# EAGLE design ADK_MEGA_2560-REV3 (EAGLE 6.5.0)
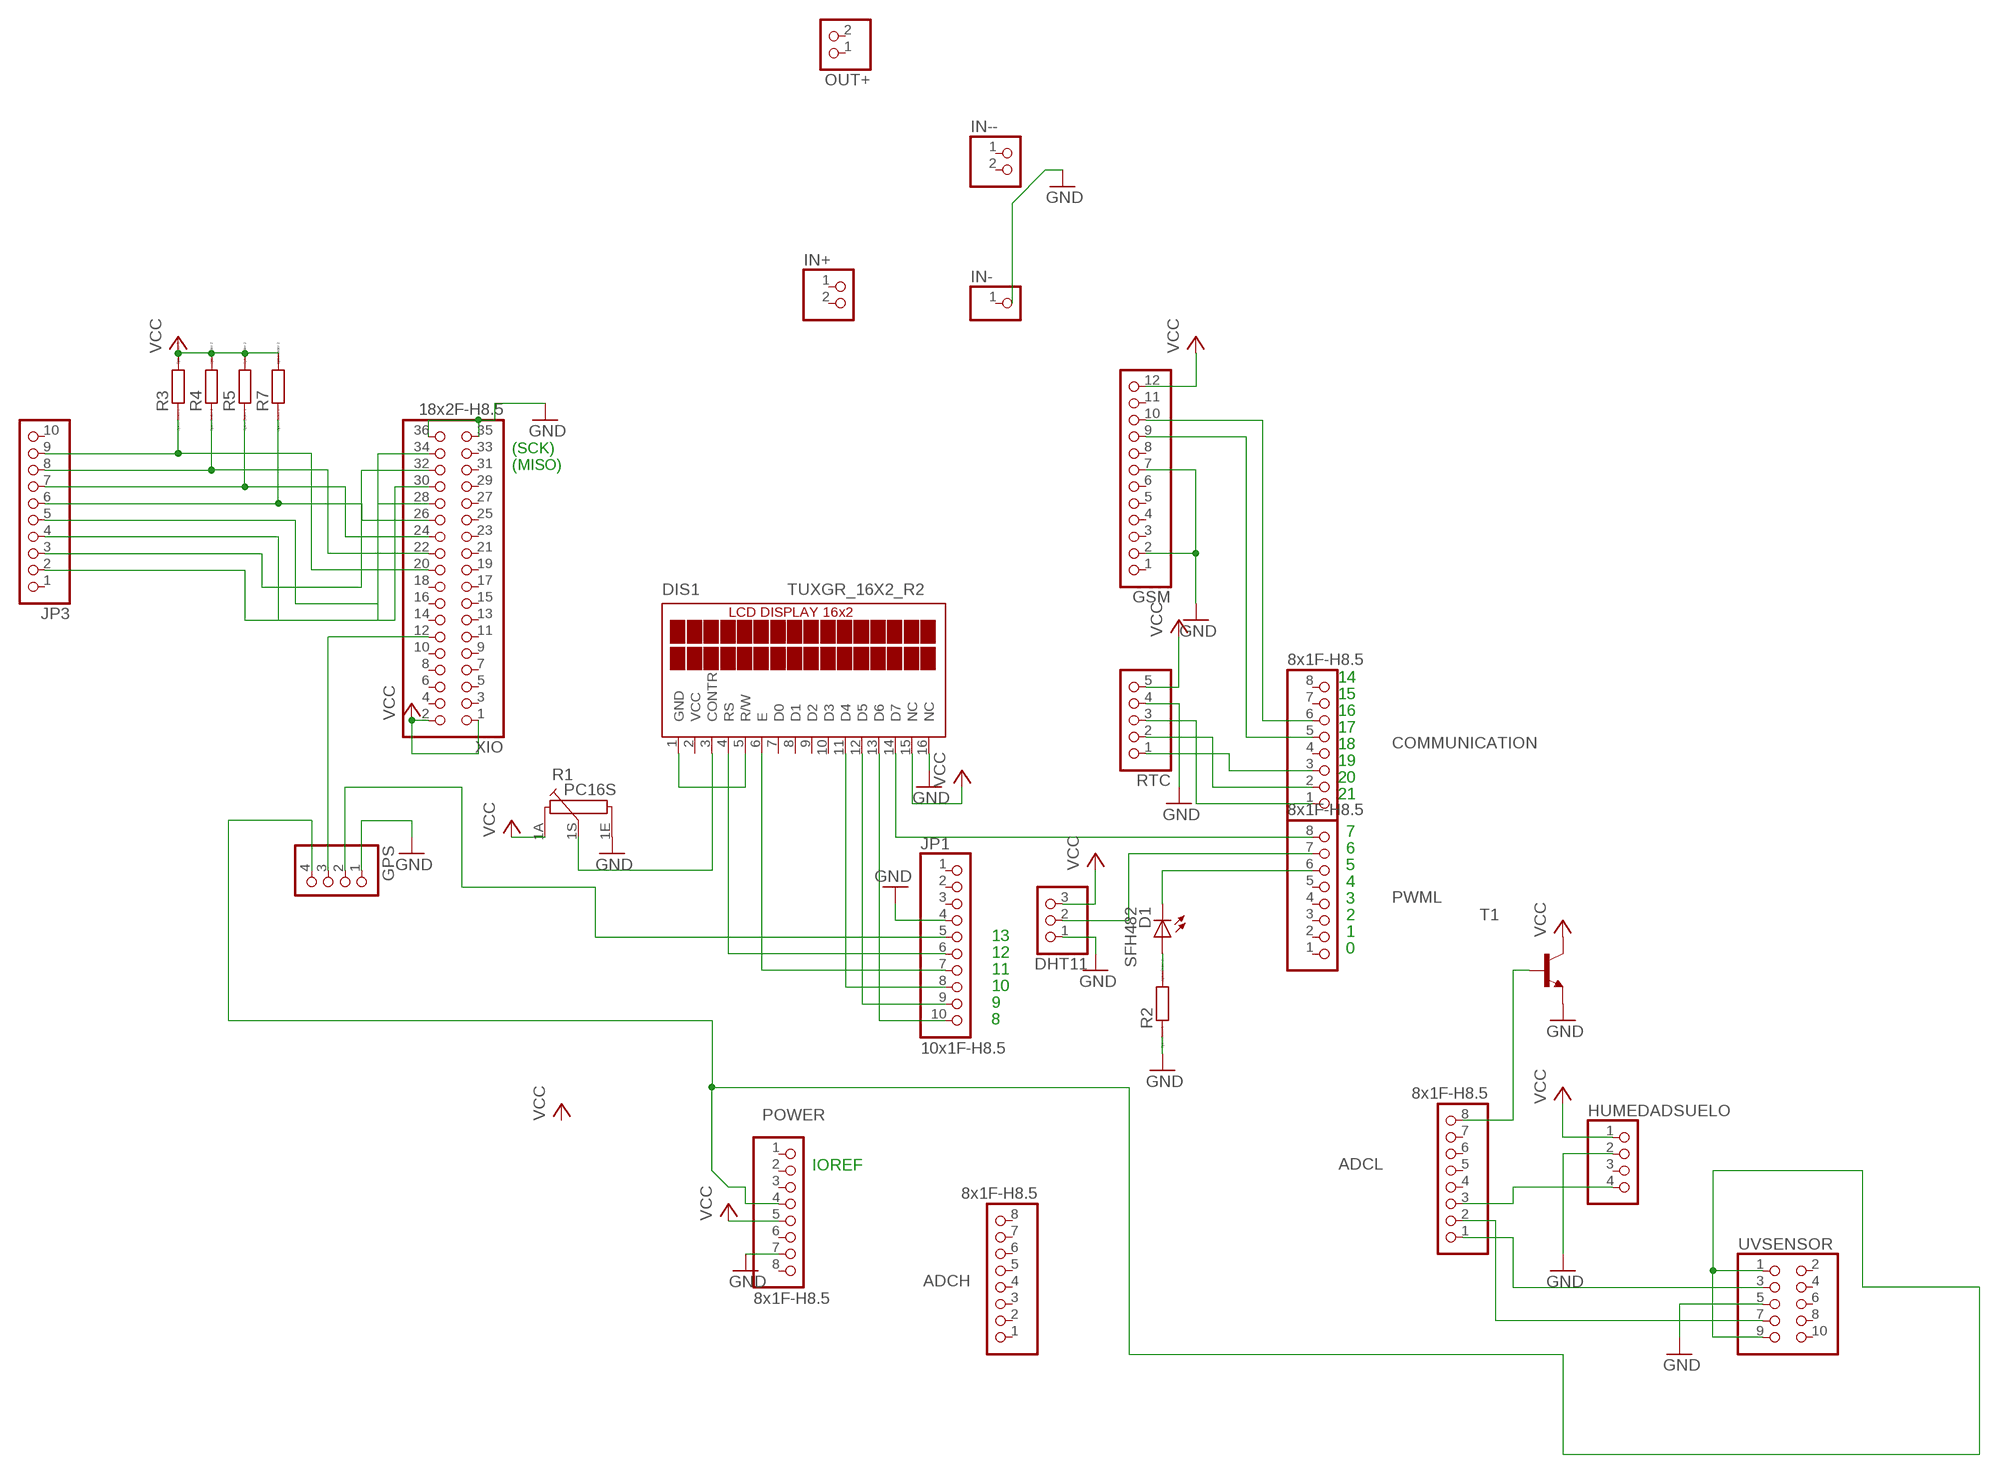
[diagram p0: schematic, sheet 1]

## Parts
ADCH  8x1F-H8.5  PINHD-1X8  [1X08]
ADCL  8x1F-H8.5  PINHD-1X8  [1X08]
COMMUNICATION  8x1F-H8.5  PINHD-1X8  [1X08]
D1  SFH482  [SFH482]
DHT11  PINHD-1X3  [1X03]
DIS1  TUXGR_16X2_R2  [TUXGR_16X2_R2]
GPS  PINHD-1X4  [1X04]
GSM  PINHD-1X12  [1X12]
HUMEDADSUELO  PINHD-1X4  [1X04]
IN+  PINHD-1X2  [1X02]
IN-  PINHD-1X1  [1X01]
IN--  PINHD-1X2  [1X02]
JP1  10x1F-H8.5  PINHD-1X10  [1X10]
JP3  PINHD-1X10/90  [1X10/90]
OUT+  PINHD-1X2  [1X02]
POWER  8x1F-H8.5  PINHD-1X8  [1X08]
PWML  8x1F-H8.5  PINHD-1X8  [1X08]
R1  PC16S  [PC16S]
R2  R0204/7  [0204/7]
R3  R0204/7  [0204/7]
R4  R0204/7  [0204/7]
R5  R0204/7  [0204/7]
R7  R0204/7  [0204/7]
RTC  PINHD-1X5  [1X05]
T1  2N2222-NPN-TO92-EBC  [TO92-EBC]
UVSENSOR  PINHD-2X5  [2X05]
XIO  18x2F-H8.5  PINHD-2X18  [2X18]

## Nets
GND: DHT11.1 DIS1.16(NC) GPS.1 GSM.2 GSM.7 HUMEDADSUELO.2 JP1.4 POWER.7 R1.1E R2.1 RTC.4 T1.E UVSENSOR.5 XIO.35 XIO.36
N$1: DIS1.3(CONTR) R1.1S
N$2: D1.K(C) PWML.6
N$3: D1.A R2.2
N$4: DIS1.14(D7) PWML.8
N$5: DIS1.1(GND) DIS1.5(R/W)
N$6: DIS1.13(D6) JP1.10
N$7: DIS1.12(D5) JP1.9
N$8: DIS1.11(D4) JP1.8
N$9: DIS1.6(E) JP1.7
N$10: DIS1.4(RS) JP1.6
N$11: GPS.2 JP1.5
N$12: DHT11.2 PWML.7
N$13: GPS.3 XIO.12
N$14: COMMUNICATION.1 RTC.3
N$15: COMMUNICATION.2 RTC.2
N$16: COMMUNICATION.3 RTC.1
N$17: ADCL.3 HUMEDADSUELO.4
N$18: ADCL.8 T1.B
N$19: ADCL.2 UVSENSOR.7
N$20: ADCL.1 UVSENSOR.3
N$22: COMMUNICATION.6 GSM.10
N$23: COMMUNICATION.5 GSM.9
N$24: JP3.9 R3.1 XIO.20
N$25: JP3.8 R4.1 XIO.22
N$26: JP3.7 R5.1 XIO.24
N$27: JP3.6 R7.1 XIO.26
N$29: GPS.4 POWER.4 UVSENSOR.1 UVSENSOR.9
N$30: JP3.5 XIO.28
N$31: JP3.4 XIO.30
N$32: JP3.3 XIO.32
N$33: JP3.2 XIO.34
VCC: DHT11.3 DIS1.15(NC) GSM.12 HUMEDADSUELO.1 POWER.5 R1.1A R3.2 R4.2 R5.2 R7.2 RTC.5 T1.C XIO.1 XIO.2
Unconnected: ADCH.1 ADCH.2 ADCH.3 ADCH.4 ADCH.5 ADCH.6 ADCH.7 ADCH.8 ADCL.4 ADCL.5 ADCL.6 ADCL.7 COMMUNICATION.4 COMMUNICATION.7 COMMUNICATION.8 DIS1.7(D0) DIS1.8(D1) DIS1.9(D2) DIS1.10(D3) GSM.1 GSM.3 GSM.4 GSM.5 GSM.6 GSM.8 GSM.11 HUMEDADSUELO.3 IN+.1 IN+.2 IN--.1 IN--.2 IN-.1 JP1.1 JP1.2 JP1.3 JP3.1 JP3.10 OUT+.1 OUT+.2 POWER.1 POWER.2 POWER.3 POWER.6 POWER.8 PWML.1 PWML.2 PWML.3 PWML.4 PWML.5 UVSENSOR.2 UVSENSOR.4 UVSENSOR.6 UVSENSOR.8 UVSENSOR.10 XIO.3 XIO.4 XIO.5 XIO.6 XIO.7 XIO.8 XIO.9 XIO.10 XIO.11 XIO.13 XIO.14 XIO.15 XIO.16 XIO.17 XIO.18 XIO.19 XIO.21 XIO.23 XIO.25 XIO.27 XIO.29 XIO.31 XIO.33

## Notes on the sheet
- (SCK)
- (MISO)
- 14
- 15
- 16
- 17
- 18
- 19
- 20
- 21
- 7
- 6
- 5
- 4
- 3
- 2
- 13 | 1
- 12 | 0
- 11
- 10
- 9
- 8
- IOREF

## Power pins joined to a net without a drawn wire
VCC: DIS1.2(VCC)

## Library data of the parts
ADCH ADCL COMMUNICATION POWER PWML = SmartPrj:PINHD-1X8: PIN HEADER
D1 = led:SFH482: IR LED infrared emitting diode, Infineon
DHT11 = pinhead:PINHD-1X3: PIN HEADER
DIS1 = display-lcd:TUXGR_16X2_R2: Tuxgraphics LCD display 16x2 characters reflective, without background light Source: tuxgr_12x2_r2.pdf; OC_FARNELL: unknown; OC_NEWARK: unknown
GPS HUMEDADSUELO = pinhead:PINHD-1X4: PIN HEADER
GSM = pinhead:PINHD-1X12: PIN HEADER
IN+ IN-- OUT+ = pinhead:PINHD-1X2: PIN HEADER
IN- = pinhead:PINHD-1X1: PIN HEADER
JP1 = SmartPrj:PINHD-1X10: PIN HEADER
JP3 = pinhead:PINHD-1X10: PIN HEADER
R1 = piher:PC16S: POTENTIOMETER single carbon potentiometer, 16 mm, S3ROH; OC_FARNELL: 4452940; OC_NEWARK: unknown
R2-R5 R7 = eagle-ltspice:R: RESISTOR, European symbol; SPICEMODEL: NONE; SPICEPREFIX: R
RTC = pinhead:PINHD-1X5: PIN HEADER
T1 = transistor-neu-to92:*-NPN-: NPN Transistror
UVSENSOR = pinhead:PINHD-2X5: PIN HEADER
XIO = SmartPrj:PINHD-2X18: PIN HEADER

## Net classes
0 default: width 0.203 mm, drill 0.406 mm, clearance 0.178 mm
1 power: width 0.305 mm, drill 0.406 mm, clearance 0.178 mm
2 gnd: width 0.305 mm, drill 0.406 mm, clearance 0.178 mm
3 power usb: width 0.508 mm, drill 0.406 mm, clearance 0.178 mm

## Board
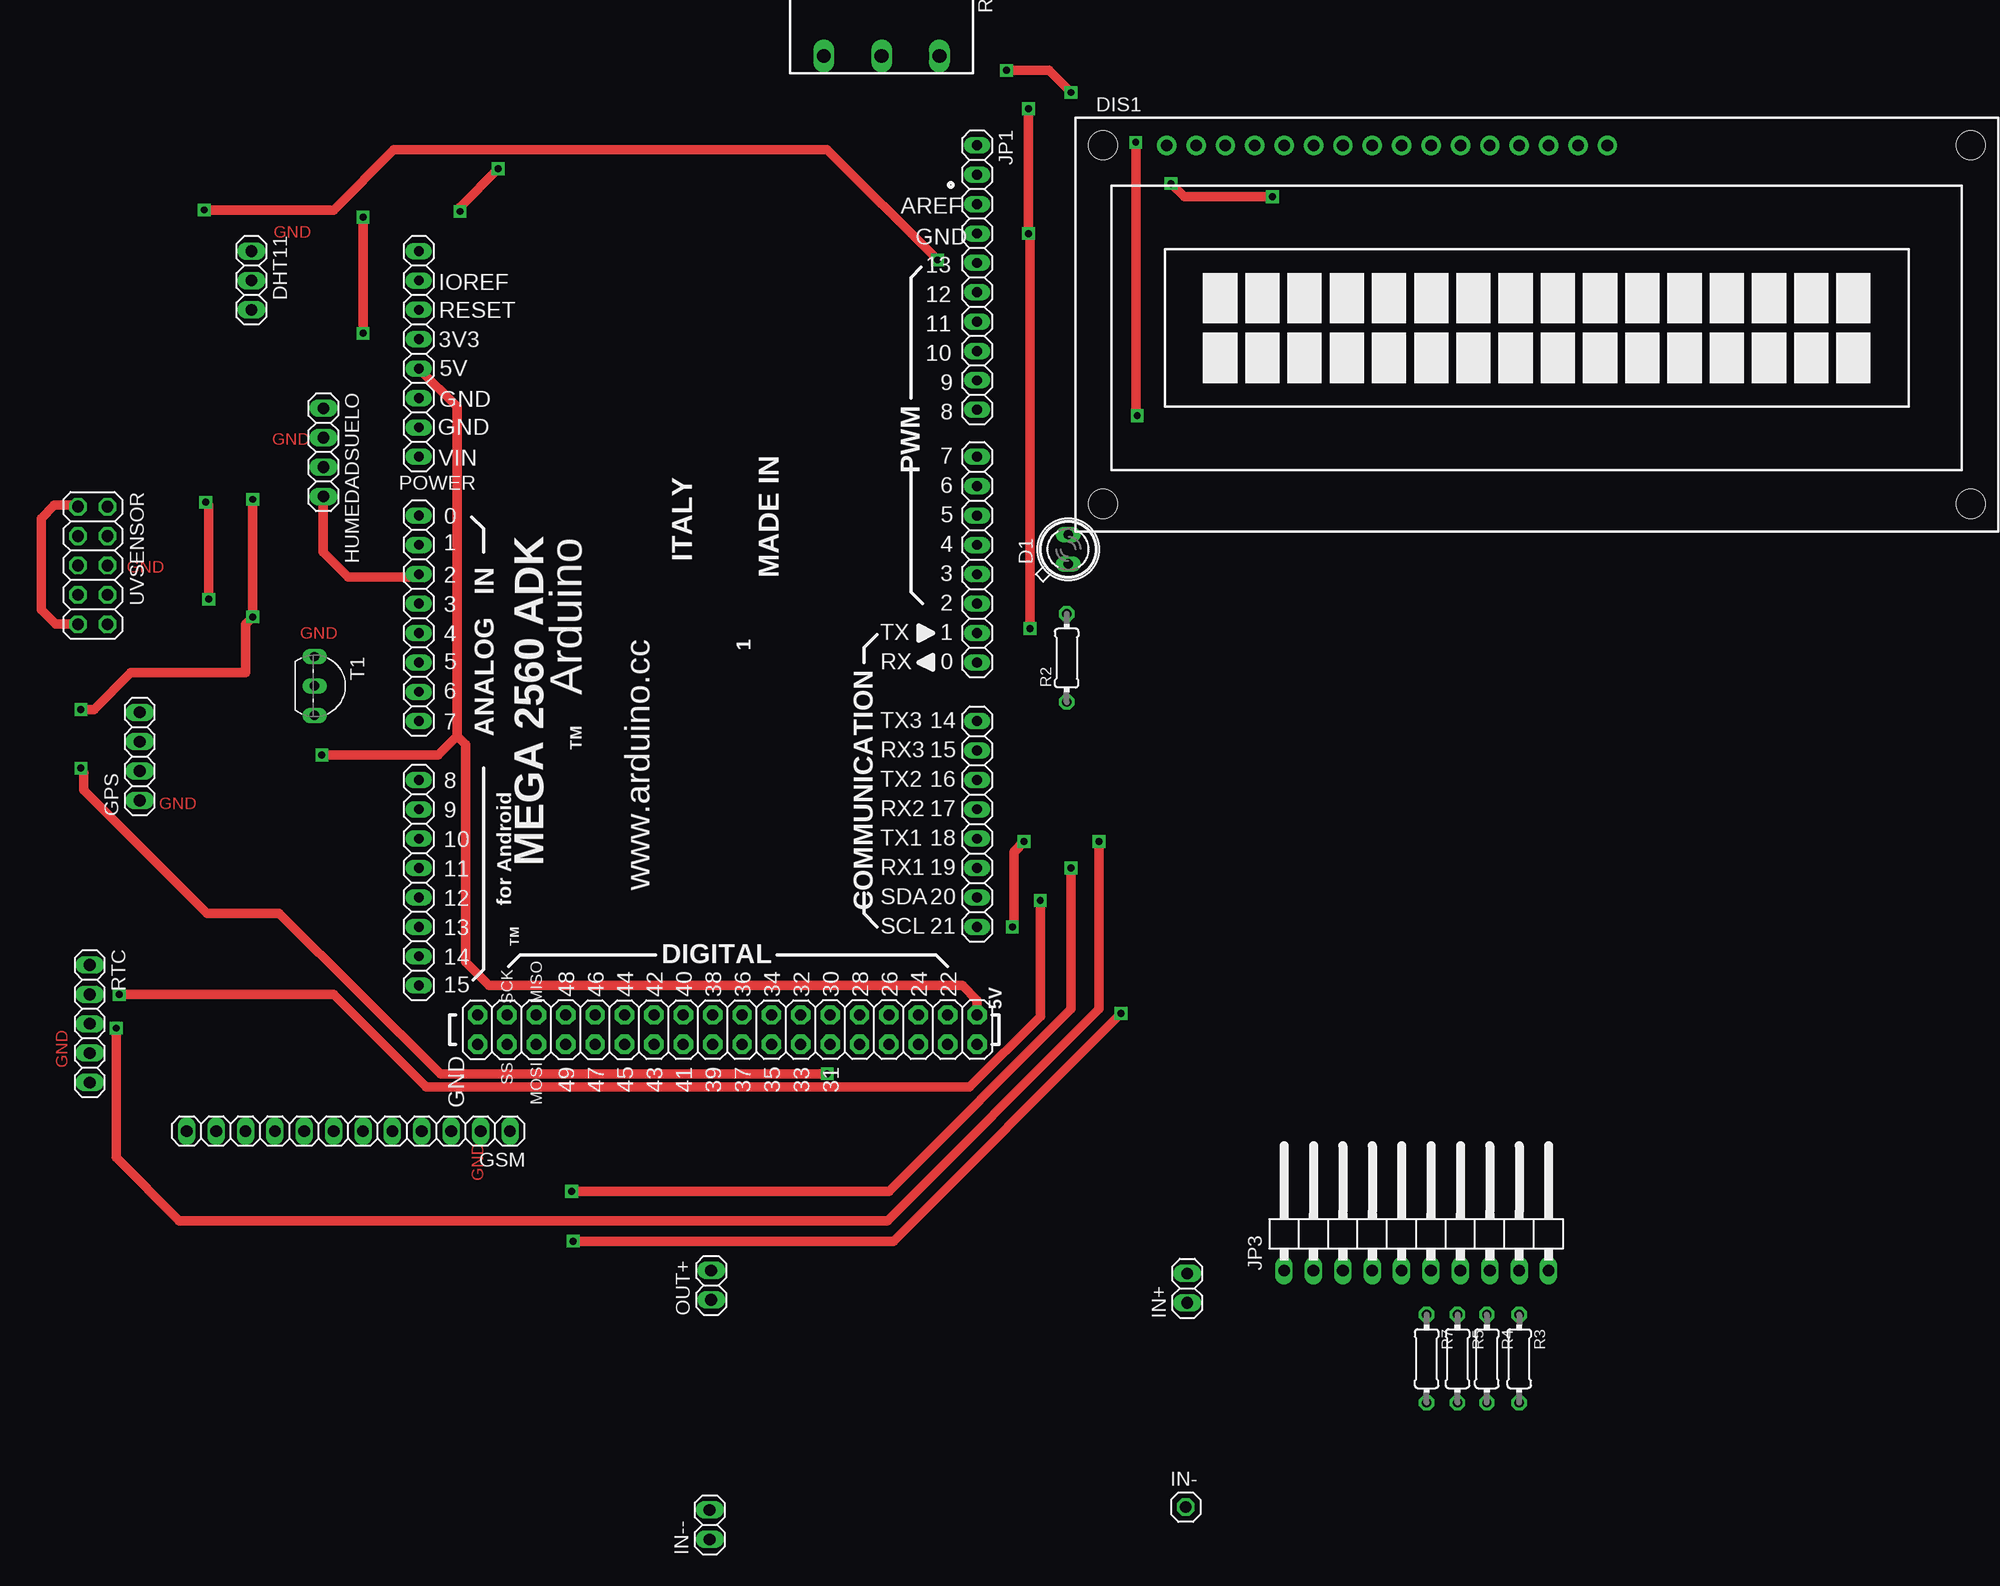
[diagram p1: board, top side]
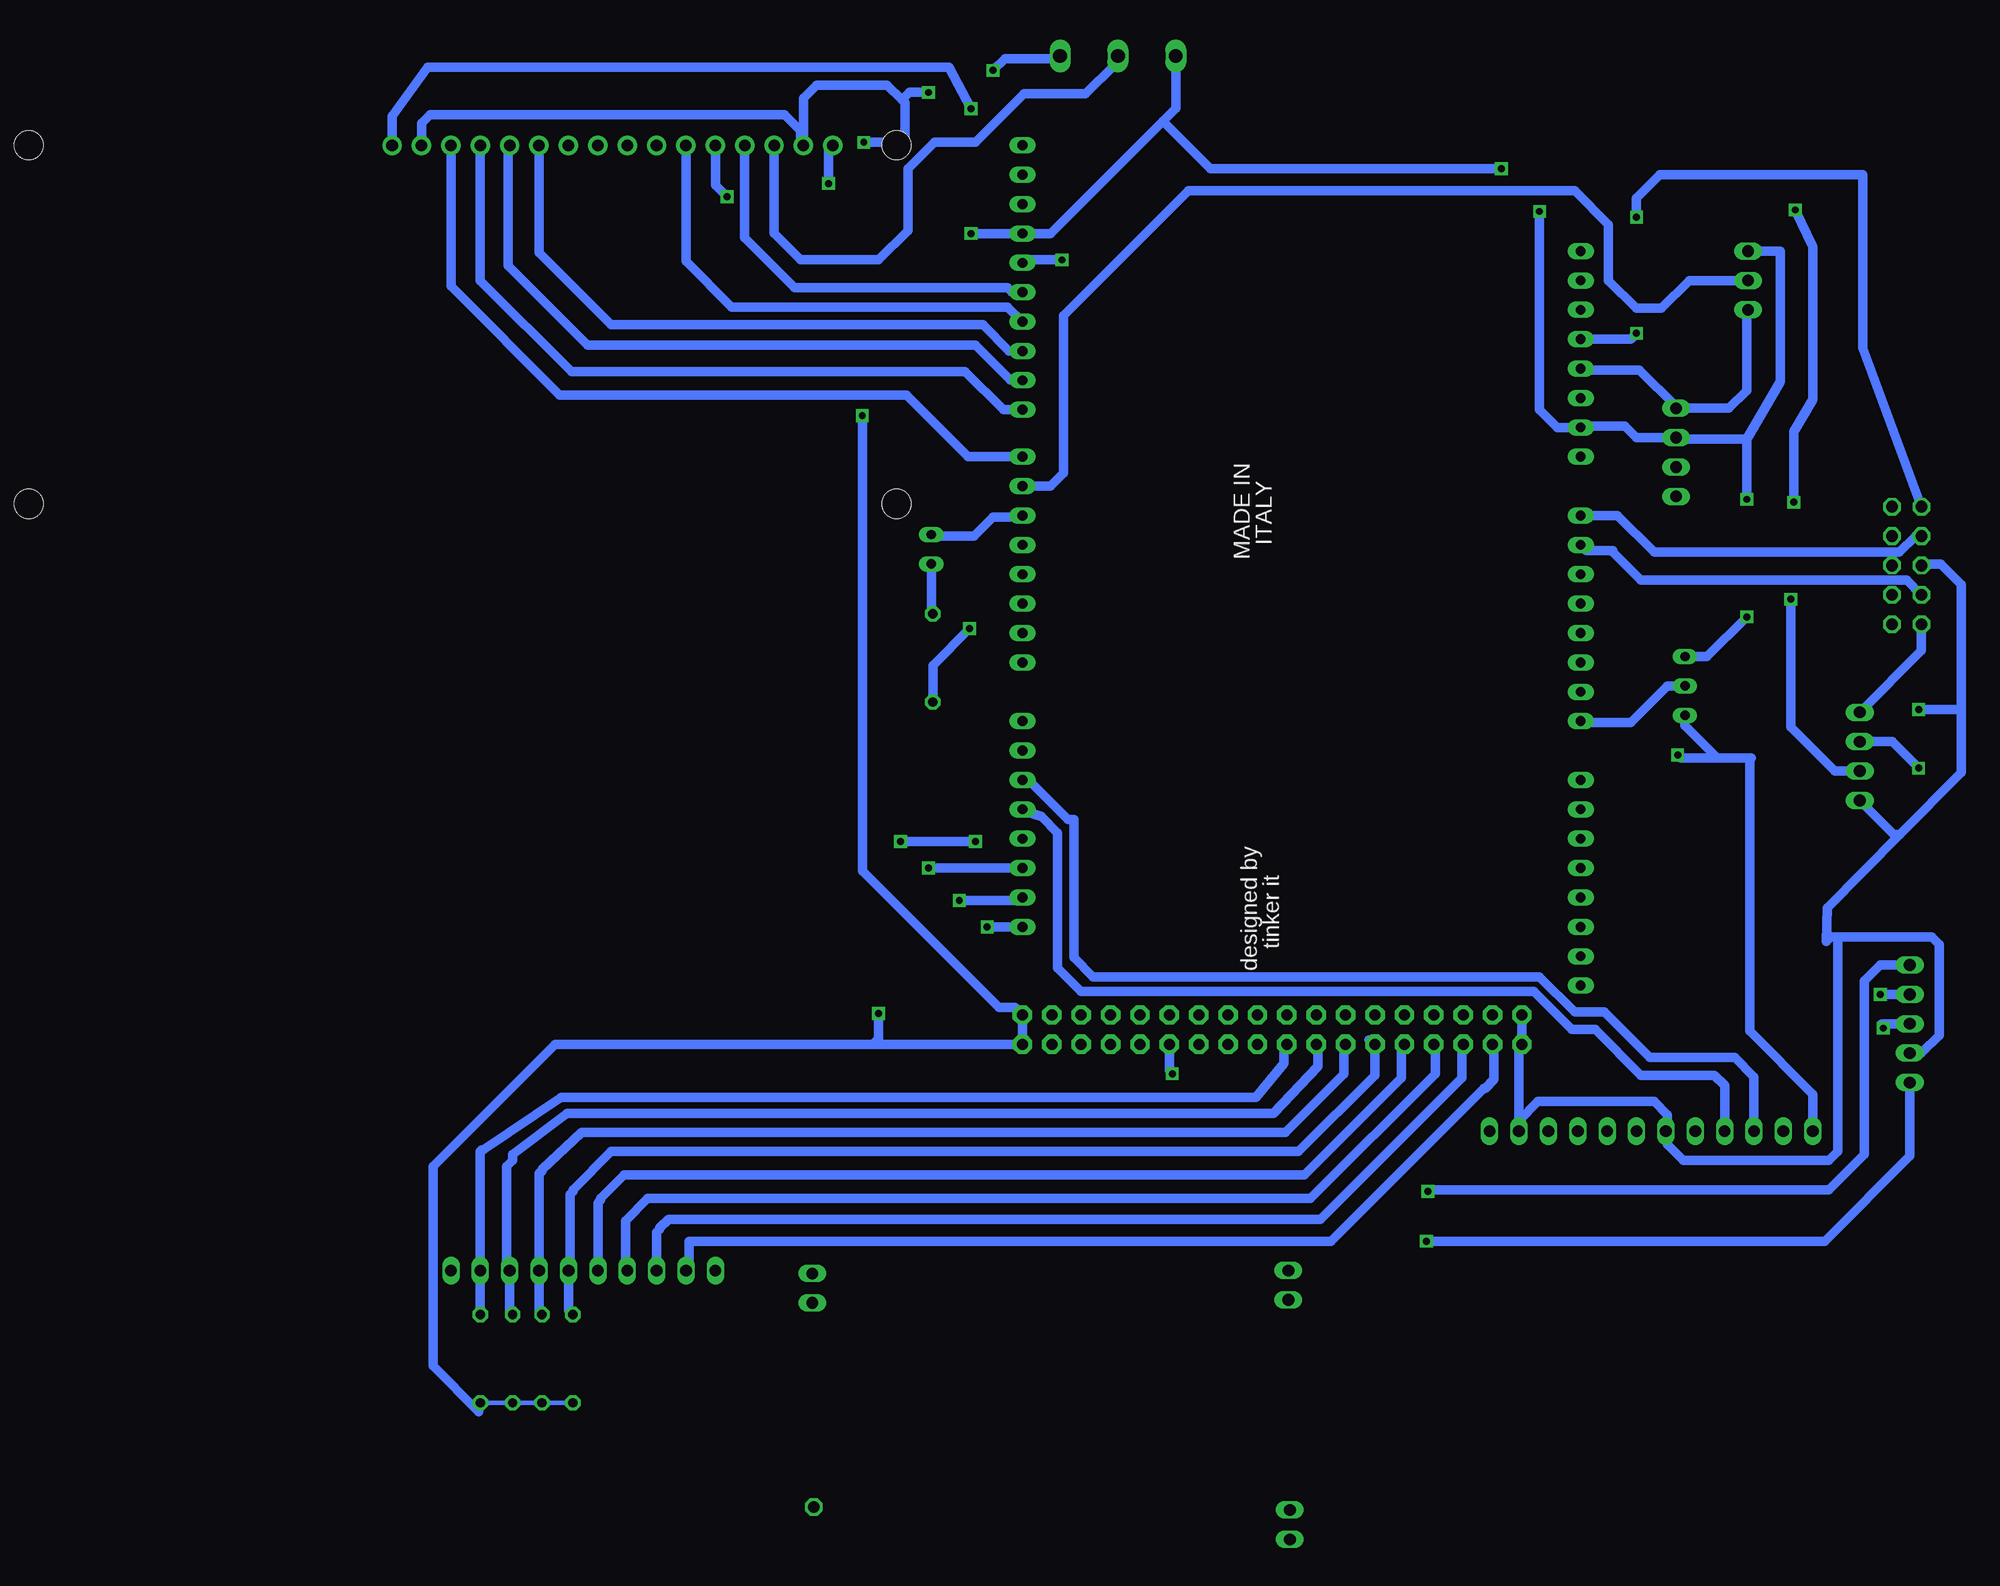
[diagram p2: board, bottom side, seen from below]

No outline drawn. Coordinates in mm, seen from the top.
Copper layers (1*16): Top 0.035mm / dielectric 1.5mm / Bottom 0.035mm
Design rules "ArduinoMegaHOST *": minimum track width 8mil, minimum drill 16mil, track to track 7mil, track to pad 7mil, pad to pad 7mil, via to via 10mil, smd to smd 7mil, copper to edge 20mil, drill to drill 12mil, minimum pad ring 10mil, minimum via ring 10mil, stop-mask expansion 2mil, vias tented up to drill 20mil, thermal gap 10mil

### Footprints (pad centres in the part's own frame; a part is rotated, then mirrored left to right if it is on the bottom)
1X08 = drill 0.85 pad 1.422 long: 1 -8.89,0; 2 -6.35,0; 3 -3.81,0; 4 -1.27,0; 5 1.27,0; 6 3.81,0; 7 6.35,0; 8 8.89,0
SFH482 = drill 0.813 long: A -1.27,0; K 1.27,0
1X03 = drill 1.016 long: 1 -2.54,0; 2 0,0; 3 2.54,0
TUXGR_16X2_R2 = drill 1 pad 1.676: 1 -32,15.5; 2 -29.46,15.5; 3 -26.92,15.5; 4 -24.38,15.5; 5 -21.84,15.5; 6 -19.3,15.5; 7 -16.76,15.5; 8 -14.22,15.5; 9 -11.68,15.5; 10 -9.14,15.5; 11 -6.6,15.5; 12 -4.06,15.5; 13 -1.52,15.5; 14 1.02,15.5; 15 3.56,15.5; 16 6.1,15.5 | hole 2.5: -37.5,-15.5; 37.5,-15.5; -37.5,15.5; 37.5,15.5
1X04 = drill 1.016 long: 1 -3.81,0; 2 -1.27,0; 3 1.27,0; 4 3.81,0
1X12 = drill 1.016 long: 1 -13.97,0; 2 -11.43,0; 3 -8.89,0; 4 -6.35,0; 5 -3.81,0; 6 -1.27,0; 7 1.27,0; 8 3.81,0; 9 6.35,0; 10 8.89,0; 11 11.43,0; 12 13.97,0
1X02 = drill 1.016 long: 1 -1.27,0; 2 1.27,0
1X01 = drill 1.016 octagon: 1 0,0
1X10 = drill 0.85 pad 1.422 long: 1 -11.43,0; 2 -8.89,0; 3 -6.35,0; 4 -3.81,0; 5 -1.27,0; 6 1.27,0; 7 3.81,0; 8 6.35,0; 9 8.89,0; 10 11.43,0
1X10/90 = drill 1.016 long: 1 -11.43,-3.81; 2 -8.89,-3.81; 3 -6.35,-3.81; 4 -3.81,-3.81; 5 -1.27,-3.81; 6 1.27,-3.81; 7 3.81,-3.81; 8 6.35,-3.81; 9 8.89,-3.81; 10 11.43,-3.81
PC16S = drill 1.2 long: 1A -5,6.5; 1E 5,6.5; 1S 0,6.5
0204/7 = drill 0.813 octagon: 1 -3.81,0; 2 3.81,0
1X05 = drill 1.016 long: 1 -5.08,0; 2 -2.54,0; 3 0,0; 4 2.54,0; 5 5.08,0
TO92-EBC = drill 0.813 long: B 0,-1.27; C 2.54,-1.27; E -2.54,-1.27
2X05 = drill 1.016 octagon: 1 -5.08,-1.27; 2 -5.08,1.27; 3 -2.54,-1.27; 4 -2.54,1.27; 5 0,-1.27; 6 0,1.27; 7 2.54,-1.27; 8 2.54,1.27; 9 5.08,-1.27; 10 5.08,1.27
2X18 = drill 0.95 pad 1.676 octagon: 1 -21.59,-1.27; 2 -21.59,1.27; 3 -19.05,-1.27; 4 -19.05,1.27; 5 -16.51,-1.27; 6 -16.51,1.27; 7 -13.97,-1.27; 8 -13.97,1.27; 9 -11.43,-1.27; 10 -11.43,1.27; 11 -8.89,-1.27; 12 -8.89,1.27; 13 -6.35,-1.27; 14 -6.35,1.27; 15 -3.81,-1.27; 16 -3.81,1.27; 17 -1.27,-1.27; 18 -1.27,1.27; 19 1.27,-1.27; 20 1.27,1.27; 21 3.81,-1.27; 22 3.81,1.27; 23 6.35,-1.27; 24 6.35,1.27; 25 8.89,-1.27; 26 8.89,1.27; 27 11.43,-1.27; 28 11.43,1.27; 29 13.97,-1.27; 30 13.97,1.27; 31 16.51,-1.27; 32 16.51,1.27; 33 19.05,-1.27; 34 19.05,1.27; 35 21.59,-1.27; 36 21.59,1.27

### Placement (x,y rotation side)
ADCH  6.1,19.43 270 top
ADCL  6.1,42.29 270 top
COMMUNICATION  54.36,24.51 90 top
D1  62.23,48.26 90 top
DHT11  -8.38,71.5 270 top
DIS1  102.74,67.69 0 top
GPS  -18.03,30.35 90 top
GSM  0,-2.03 180 top
HUMEDADSUELO  -2.16,56.64 270 top
IN+  72.52,-15.62 90 top
IN-  72.39,-34.54 0 top
IN--  31.24,-36.07 90 top
JP1  54.36,71.75 270 top
JP3  92.33,-10.29 0 top
OUT+  31.37,-15.37 90 top
POWER  6.1,65.15 270 top
PWML  54.36,47.37 90 top
R1  46.1,97.41 180 top
R2  62.1,38.86 90 top
R3  101.22,-21.72 270 top
R4  98.42,-21.72 270 top
R5  95.89,-21.72 270 top
R7  93.22,-21.72 270 top
RTC  -22.35,7.24 270 top
T1  -1.65,36.45 270 top
UVSENSOR  -22.1,46.86 270 top
XIO  32.77,6.73 180 top

### Tracks (layer width: path | path; a pad name or v marks a point on that pad's centre or on a via)
GND  (via drill 0.6)
  Top 0.813: v58.8,86.36 v58.8,75.56 58.93,75.44 v58.93,41.4 | v-8.26,52.58 v-8.26,42.42 -8.89,41.78 -8.89,37.59 -18.8,37.59 -21.97,34.42 v-23.11,34.42 | v9.65,77.47 9.65,77.85 v12.95,81.15
  Bottom 0.813: XIO.35 XIO.36 11.43,5.21 GSM.2 11.43,-1.14 9.78,0.51 -0.25,0.51 -1.4,-0.64 -1.4,-1.91 | DIS1.16 108.84,85.72 105.79,89.92 60.71,89.92 v58.8,86.36 | -1.4,-1.91 GSM.7 | -1.4,-1.91 -1.4,-3.17 -2.79,-4.57 -15.37,-4.57 -16.13,-3.81 -16.13,14.61 -16,14.73 | -21.49,23.59 -15.24,17.27 -15.16,14.37 -15.52,14.73 -16,14.73 | -21.49,23.59 -26.8,28.96 -26.8,34.16 | v58.8,75.56 JP1.4 51.94,75.56 42.23,85.28 | GPS.1 -20.98,23.59 -21.49,23.59 | DHT11.1 -11.18,74.04 -11.18,62.74 -8.26,57.78 | -8.26,57.78 -2.29,57.78 HUMEDADSUELO.2 1.27,57.91 2.29,58.93 6.48,58.93 6.6,58.8 | T1.E -4.83,38.99 v-8.26,42.42 | v-8.26,52.58 -8.26,57.78 | -26.8,34.16 -26.8,45.21 -25.02,46.99 -23.5,46.99 UVSENSOR.5 | v-23.11,34.42 -26.54,34.42 -26.8,34.16 | RTC.4 -23.37,4.7 -24.89,6.22 -24.89,14.1 -24.26,14.73 -16,14.73 | R2.1 62.1,38.23 v58.93,41.4 | R1.1E 41.1,86.41 42.23,85.28 | POWER.7 6.6,58.8 | 6.6,58.8 8.13,58.8 9.65,60.33 v9.65,77.47 | v12.95,81.15 38.1,81.15 42.23,85.28
N$1
  Bottom 0.813: DIS1.3 75.82,75.57 73.53,73.28 66.8,73.28 64.26,75.82 64.26,81.15 61.98,83.44 58.42,83.44 54.23,87.63 48.9,87.63 46.35,90.17 46.35,90.66 R1.1S
N$2
  Bottom 0.813: PWML.6 54.48,51.05 56.9,51.05 58.55,49.4 62.1,49.4 D1.K
N$3
  Bottom 0.813: D1.A 62.23,42.8 R2.2
N$4
  Bottom 0.813: DIS1.14 103.76,71 94.36,61.59 64.39,61.59 59.05,56.26 PWML.8
N$5  (via drill 0.6)
  Top 0.813: v79.88,78.74 72.26,78.74 v71.12,79.88
  Bottom 0.813: DIS1.5 80.9,79.76 v79.88,78.74 | v71.12,79.88 71.12,82.81 DIS1.1
N$6
  Bottom 0.813: JP1.10 56.01,60.33 59.31,63.63 93.34,63.63 101.22,71.5 DIS1.13
N$7
  Bottom 0.813: JP1.9 55.37,62.87 58.42,65.91 91.95,65.91 98.81,72.77 98.81,83.07 DIS1.12
N$8
  Bottom 0.813: JP1.8 55.5,65.41 57.78,67.69 89.92,67.69 96.14,73.91 DIS1.11
N$9
  Bottom 0.813: DIS1.6 83.44,73.16 79.5,69.22 55.63,69.22 JP1.7
N$10
  Bottom 0.813: JP1.6 55.24,70.48 55.63,70.87 74.04,70.87 78.36,75.19 DIS1.4
N$11  (via drill 0.6)
  Top 0.813: v-12.06,43.94 -12.06,52.07 v-12.32,52.32 | v-12.45,77.6 -1.27,77.6 3.94,82.8 41.4,82.8 v50.93,73.28
  Bottom 0.813: GPS.2 -15.88,29.08 -12.06,32.89 v-12.06,43.94 | v-12.32,52.32 -12.32,58.42 -13.97,61.21 -13.97,74.42 v-12.45,77.6 | v50.93,73.28 54.1,73.28 JP1.5
N$12
  Bottom 0.813: DHT11.2 -3.3,71.5 -0.89,69.09 1.27,69.09 3.68,71.5 3.68,76.33 6.6,79.25 40.01,79.25 50.8,68.45 50.8,54.86 51.94,53.72 PWML.7
N$13  (via drill 0.6)
  Top 0.813: v-23.11,29.34 -22.99,29.08 -22.86,28.96 -22.86,27.43 -12.19,16.76 -5.97,16.76 8,2.92 v41.4,2.92
  Bottom 0.813: GPS.3 -20.83,31.62 v-23.11,29.34 | v41.4,2.92 41.66,3.17 XIO.12
N$14  (via drill 0.6)
  Top 0.813: v-20.07,6.86 -20.07,-4.32 -14.61,-9.78 46.61,-9.78 64.9,8.51 v64.9,22.99 | v58.42,22.99 57.53,22.1 57.53,15.75 v57.4,15.62
  Bottom 0.813: RTC.3 -19.94,7.24 v-20.07,6.86 | v64.9,22.99 v58.42,22.99 | v57.4,15.62 COMMUNICATION.1
N$15  (via drill 0.6)
  Top 0.813: v-19.81,9.78 -1.27,9.78 6.73,1.78 53.72,1.78 59.82,7.87 v59.82,17.91
  Bottom 0.813: RTC.2 v-19.81,9.78 | v59.82,17.91 54.61,17.91 COMMUNICATION.2
N$16  (via drill 0.6)
  Top 0.813: v19.3,-7.24 46.74,-7.24 62.48,8.51 v62.48,20.7
  Bottom 0.813: RTC.1 -19.81,12.32 -18.41,10.92 -18.41,-4.06 -15.37,-7.11 19.18,-7.11 v19.3,-7.24 | v62.48,20.7 COMMUNICATION.3
N$17
  Top 0.813: HUMEDADSUELO.4 -2.16,48.01 0,45.85 5.84,45.85 ADCL.3
N$18
  Bottom 0.813: T1.B -1.4,36.45 1.78,33.27 5.97,33.27 ADCL.8
N$19
  Bottom 0.61: 6.22,48.51 ADCL.2
  Bottom 0.813: 5.97,48.51 ADCL.2 5.59,48.13 3.3,48.13 3.3,48.01 0.89,45.59 -22.1,45.59 UVSENSOR.7
N$20
  Bottom 0.813: UVSENSOR.3 -22.86,49.4 -21.46,48.01 -0.25,48.01 2.92,51.18 ADCL.1
N$22
  Bottom 0.813: GSM.10 -8.89,2.67 -7.24,4.32 0.13,4.32 4.06,8.26 6.6,8.26 9.65,11.3 48.26,11.3 49.91,12.95 49.91,24.89 50.42,24.89 53.72,28.19 54.23,28.45 COMMUNICATION.6
N$23
  Bottom 0.813: GSM.9 -6.35,1.91 -5.46,2.79 0.89,2.79 4.83,6.73 6.86,6.73 10.16,10.03 49.28,10.03 51.31,12.06 51.31,23.75 52.7,25.15 54.23,25.65 COMMUNICATION.5
N$24
  Bottom 0.813: XIO.20 31.75,5.21 31.75,3.81 34.16,0.89 94.23,0.89 100.97,-3.68 101.09,-3.68 101.22,-3.81 JP3.9 R3.1
N$25
  Bottom 0.813: XIO.22 28.83,5.33 28.83,3.56 32.64,-0.51 93.73,-0.51 98.42,-4.06 98.42,-4.57 98.93,-5.08 98.93,-13.84 JP3.8 98.68,-17.65 R4.1
N$26
  Bottom 0.813: XIO.24 26.54,5.33 26.54,2.92 31.62,-2.16 92.46,-2.16 95.89,-5.33 95.89,-5.46 96.14,-5.71 JP3.7 96.14,-17.65 R5.1
N$27
  Bottom 0.813: XIO.26 24.26,5.84 24.38,5.84 23.88,5.33 23.88,2.79 30.48,-3.81 89.92,-3.81 93.22,-7.11 93.22,-7.24 93.47,-7.49 93.47,-13.97 JP3.6 93.6,-17.53 R7.1
N$29  (via drill 0.6)
  Top 0.813: v1.27,76.96 v1.27,66.93 | UVSENSOR.9 -25.27,41.78 -26.54,43.05 -26.54,50.93 -25.4,52.07 -23.5,52.07 UVSENSOR.1
  Bottom 0.813: UVSENSOR.1 -18.29,65.66 -18.29,80.64 -0.76,80.64 1.27,78.61 v1.27,76.96 | v1.27,66.93 1.78,66.42 POWER.4 | GPS.4 -23.37,39.5 UVSENSOR.9
N$30
  Bottom 0.813: XIO.28 21.59,5.21 21.59,2.54 29.97,-5.84 88.77,-5.84 90.81,-7.87 90.81,-8 91.06,-8.26 JP3.5
N$31
  Bottom 0.813: XIO.30 18.67,5.33 18.67,2.92 29.46,-7.87 86.74,-7.87 88.65,-9.78 88.65,-13.97 JP3.4
N$32
  Bottom 0.813: XIO.32 16.38,5.33 16.38,2.54 28.57,-9.65 84.96,-9.65 85.72,-10.41 85.72,-10.54 85.98,-10.79 JP3.3
N$33
  Bottom 0.813: XIO.34 13.59,5.33 13.59,2.41 14.35,1.65 14.48,1.65 27.69,-11.56 83.19,-11.56 83.19,-13.84 JP3.2
VCC  (via drill 0.6)
  Top 0.813: v68.07,83.44 68.07,59.94 v68.2,59.82 | POWER.5 9.4,60.58 9.4,32.13 | 9.4,32.13 7.75,30.48 v-2.29,30.48 | 9.4,32.13 10.16,31.37 10.16,12.57 12.19,10.54 53.09,10.54 54.36,9.27 XIO.1 | v19.43,-11.56 47.12,-11.56 v66.8,8.13 | v56.9,89.66 60.58,89.66 v62.48,87.76
  Bottom 0.406: R3.2 R4.2 R5.2 R7.2
  Bottom 0.813: DIS1.15 106.3,85.09 105.54,85.85 74.93,85.85 73.53,84.45 73.53,83.44 DIS1.2 | DIS1.2 73.28,83.06 | 67.31,5.46 94.74,5.46 105.28,-5.08 105.28,-22.35 101.35,-26.29 101.35,-25.65 R3.2 | v68.2,59.82 68.2,20.45 56.39,8.64 54.99,8.64 XIO.1 XIO.2 67.31,5.46 | DHT11.3 -8.26,68.83 -8.26,61.98 -6.73,60.45 HUMEDADSUELO.1 -2.16,60.58 1.02,63.75 5.97,63.75 POWER.5 | v-2.29,30.48 -2.54,30.23 -5.71,30.23 | -5.71,30.23 -8.64,30.23 -8.51,30.1 -8.51,6.6 -13.97,1.14 GSM.12 | R1.1A 51.1,90.76 51.18,90.68 55.88,90.68 v56.9,89.66 | v68.07,83.44 64.77,83.44 64.52,83.69 64.52,86.87 64.77,87.12 | T1.C -2.92,33.02 -5.71,30.23 | RTC.5 -22.35,-4.19 -14.99,-11.56 v19.43,-11.56 | v66.8,8.13 66.8,5.97 67.31,5.46 | DIS1.2 73.28,87.25 72.14,88.39 66.04,88.39 64.77,87.12 | v62.48,87.76 64.14,87.76 64.77,87.12

### Text on the board
Top: GND | GND | GND | GND | GND | GND | GND
tNames: AREF | GND | 13 | IOREF | 12 | RESET | 11 | 3V3 | 10 | 5V | 9 | GND | PWM | 8 | GND | MADE IN | 7 | VIN | ITALY | 6 | 5 | 0 | MEGA 2560 ADK | Arduino | 1 | 4 | ANALOG IN | 2 | 3 | 3 | 2 | www.arduino.cc | 4 | 1 | TX | 1 | 5 | RX | 0 | 6 | 7 | TM | TX3 | 14 | RX3 | 15 | 8 | TX2 | 16 | for Android | 9 | RX2 | 17 | TX1 | 18 | 10 | 11 | RX1 | 19 | SDA | 20 | 12 | TM | 13 | SCL | 21 | MISO | 14 | SCK | 48 | 46 | 44 | 42 | DIGITAL | 40 | 38 | 36 | 34 | 32 | 30 | 28 | 26 | 24 | 22 | 15 | 5V | GND | SS | MOSI | 49 | 47 | 45 | 43 | 41 | 39 | 37 | 35 | 33 | 31
bNames: ITALY | MADE IN | tinker it | designed by